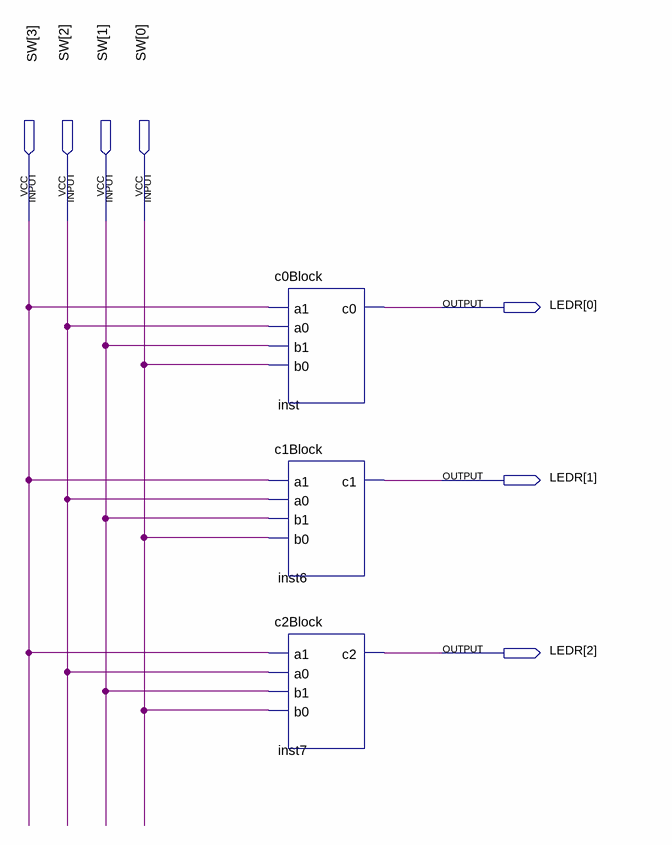
[diagram p0: schematic sheet]
// Quartus schematic Lab2Adder.bdf as structural Verilog: 3 symbols, 7 pins
module Lab2Adder (
  input  [3:0] SW,
  output [2:0] LEDR
);

  c0Block inst (.a1(SW[3]), .a0(SW[2]), .b1(SW[1]), .b0(SW[0]), .c0(LEDR[0]));
  c1Block inst6 (.a1(SW[3]), .a0(SW[2]), .b1(SW[1]), .b0(SW[0]), .c1(LEDR[1]));
  c2Block inst7 (.a1(SW[3]), .a0(SW[2]), .b1(SW[1]), .b0(SW[0]), .c2(LEDR[2]));
endmodule
